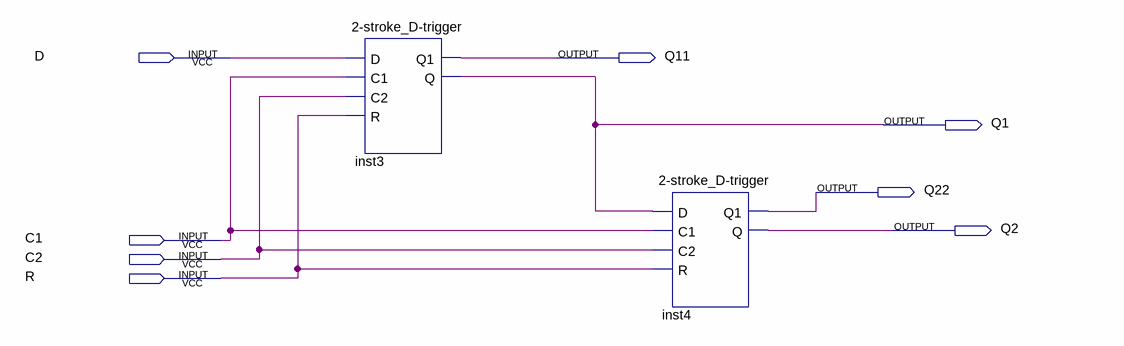
[diagram p0: schematic sheet]
// Quartus schematic 2-stroke_two-digit_shift_register.bdf as structural Verilog: 2 symbols, 8 pins
module \2-stroke_two-digit_shift_register  (
  input  D,
  input  C1,
  input  C2,
  input  R,
  output Q11,
  output Q1,
  output Q22,
  output Q2
);

  \2-stroke_D-trigger  inst3 (.D(D), .C1(C1), .C2(C2), .R(R), .Q1(Q11), .Q(Q1));
  \2-stroke_D-trigger  inst4 (.D(Q1), .C1(C1), .C2(C2), .R(R), .Q1(Q22), .Q(Q2));
endmodule
